# Altium schematic sheet Power.SchDoc: DC DC converter
size A4; Author: Sajitha Madugalle; Revision: 1; SheetNumber: 4; SheetTotal: 9
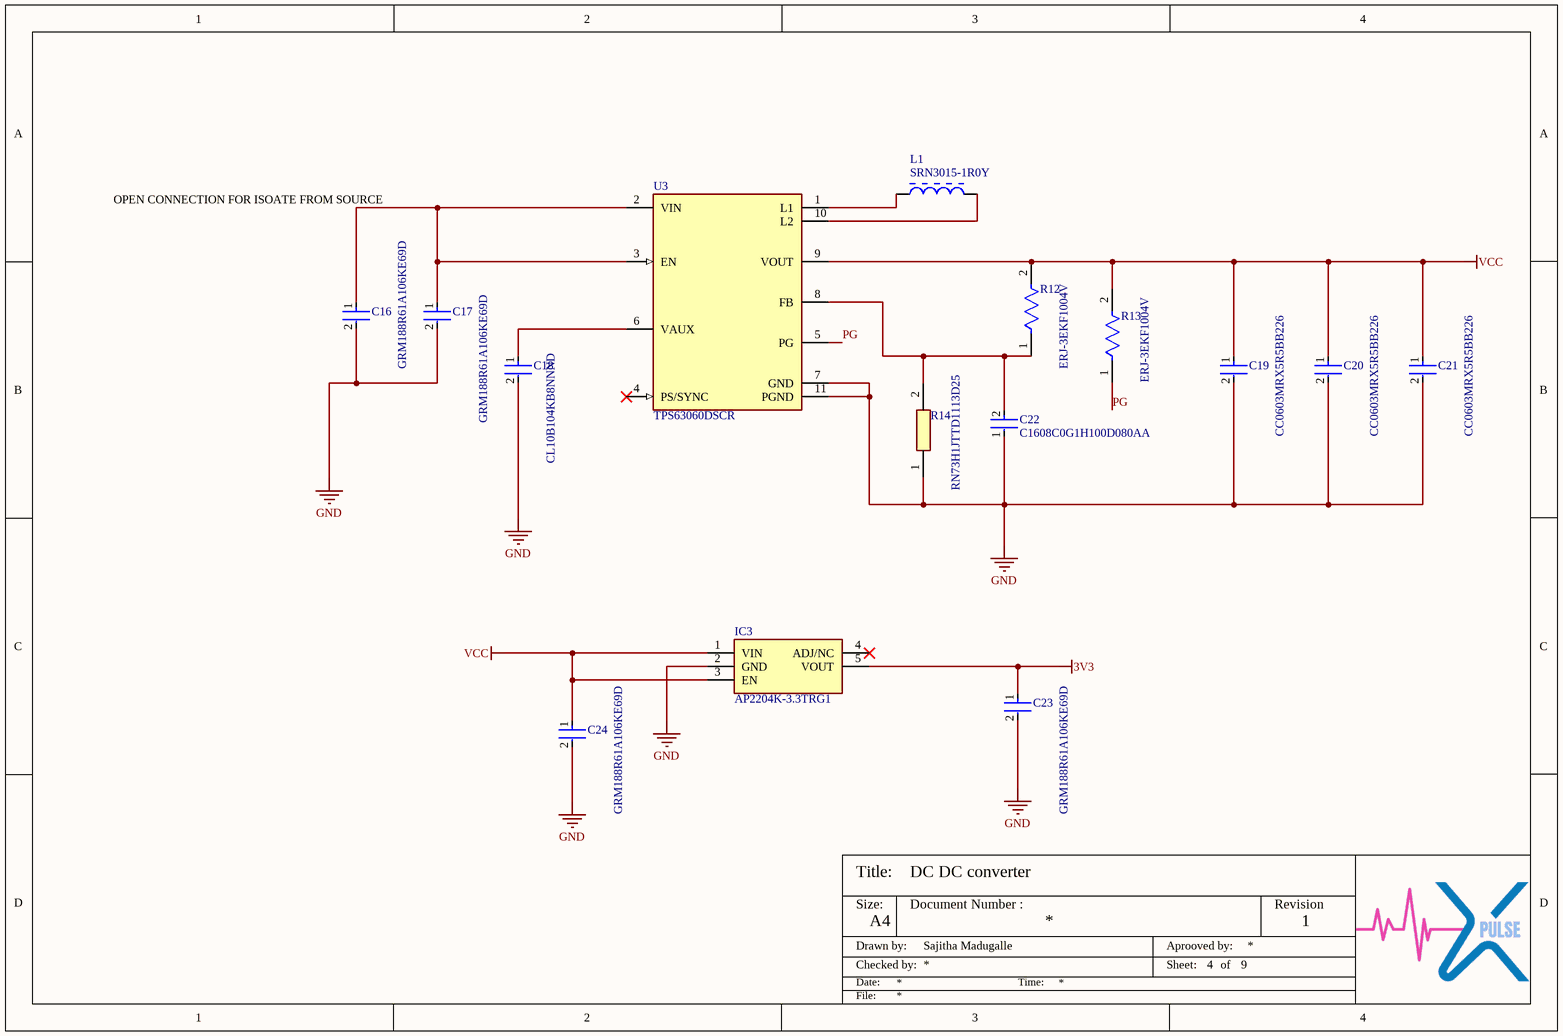
[diagram p0: Power.SchDoc]

## Parts
C16  GRM188R61A106KE69D  [FP-GRM18-0_15-MFG]
C17  GRM188R61A106KE69D  [FP-GRM18-0_15-MFG]
C18  CL10B104KB8NNND  [FP-CL10-IPC_A]
C19  CC0603MRX5R5BB226  [FP-CC0603-DC-MFG]
C20  CC0603MRX5R5BB226  [FP-CC0603-DC-MFG]
C21  CC0603MRX5R5BB226  [FP-CC0603-DC-MFG]
C22  C1608C0G1H100D080AA  [FP-C1608-080-0_1-IPC_C]
C23  GRM188R61A106KE69D  [FP-GRM18-0_15-MFG]
C24  GRM188R61A106KE69D  [FP-GRM18-0_15-MFG]
IC3  AP2204K-3.3TRG1  [SOT95P282X145-5N]
L1  SRN3015-1R0Y  [BOUR-SRN3015-2_V]
R12  ERJ-3EKF1004V  [FP-ERJ3EK-IPC_C]
R13  ERJ-3EKF1004V  [FP-ERJ3EK-IPC_C]
R14  RN73H1JTTD1113D25  [RESC1608X55N]
U3  TPS63060DSCR  [FP-DSC0010G-MFG]

## Nets
3V3: C23.1 IC3.5(VOUT)
GND: C16.2 C17.2 C18.2 C19.2 C20.2 C21.2 C22.1 C23.2 C24.2 IC3.2(GND) R14.1 U3.7(GND) U3.11(PGND)
VCC: C19.1 C20.1 C21.1 C24.1 IC3.1(VIN) IC3.3(EN) R12.2 R13.2 U3.9(VOUT)
PG: R13.1 U3.5(PG)
NetC16_1: C16.1 C17.1 U3.2(VIN) U3.3(EN)
NetC18_1: C18.1 U3.6(VAUX)
NetC22_2: C22.2 R12.1 R14.2 U3.8(FB)
NetL1_1: L1.1 U3.1(L1)
NetL1_2: L1.2 U3.10(L2)

Not connected (* = marked no-connect by the designer): IC3 4(ADJ/NC)*; U3 4(PS/SYNC)*

## Notes on the sheet
- OPEN CONNECTION FOR ISOATE FROM SOURCE
- Title:
- Size:
- Document Number :
- Revision
- Drawn by:
- Checked by:
- Date:
- A4
- Time:
- Aprooved by:
- Sheet:
- of
- File:

## Library data of the parts
C16 C17 C23 C24 = CMP-2000-05448-2: CAP CER 10UF 10V X5R 0603; Manufacturer: Murata; Temperature Coefficient: 15%; Material: Ceramic; Tolerance: 10%; Device Class L1: Passive Components; ComponentLink2Description: Datasheet; Height: 0.95mm; Package: GRM18-0.15; Octopart: https://octopart.com/grm188r61a106ke69d-murata-22851381; Manufacturer Part Number: GRM188R61A106KE69D; Value: 10uF; Digikey Description: CAP CER 10UF 10V X5R 0603; Temperature Range High: +85°C; Temperature Range Low: -55°C; Temperature Characteristic: X5R; Capacitance: 10uF; RoHS: TRUE; Device Class L2: Capacitors; ComponentLink2URL: https://search.murata.co.jp/Ceramy/image/img/A01X/G101/ENG/GRM188R61A106KE69-01A.pdf; Device Class L3: Ceramic Capacitors; Lead Free: Yes; Mouser Description: Multilayer Ceramic Capacitors MLCC - SMD/SMT 0603 10uF 10volts X5R + - 10%; Category: Cap; Voltage Rating: 10V; Temperature: -55°C to +85°C; Automotive: No
C18 = CMP-13271-000587-1: Cap Ceramic 100nF 50V X7R ±10% Pad SMD 0603 +125°C T/R; Case/Package: 0603; Depth: 0.8mm; Max Operating Temperature: 125°C; Lead Free: Lead Free; Material: Ceramic; Voltage Rating: 50V; Min Operating Temperature: -55°C; Voltage Rating (DC): 50V; Dielectric: X7R; Height: 0.8mm; Capacitance: 100nF; Thickness: 0.035inch; Radiation Hardening: No; Voltage: 50V; Packaging: Tape and Reel; Length: 1.6mm; Tolerance: 10%; Width: 0.031inch; Mount: Surface Mount; Package Quantity: 10000
C19-C21 = CMP-2000-06075-2: CAP CER 22UF 6.3V X5R 0603; Tolerance: 20%; Termination: SMD/SMT; Mount: Surface Mount; Depth: 0.8mm; Thickness: 0.035inch; Packaging: Tape and Reel; RoHS Compliant: Yes; Case/Package: 0603; Min Operating Temperature: -55°C; Package Quantity: 4000; Weight: 7.1E-05oz; Max Operating Temperature: 85°C; Voltage Rating (DC): 6.3V; Halogen Free: Halogen Free; Lead Free: Lead Free; Resistor Type: Ceramic; Case Code (Imperial): 0603; Width: 0.031inch; Case Code (Metric): 1608; Voltage Rating: 6.3V; Length: 0.063inch; Capacitance: 22uF; Dielectric: X5R
C22 = CMP-08246-005843-1: Multilayer Ceramic Capacitors 10pF ±0.5pF 50V C0G SMD 0603; Temperature Coefficient: 30ppm/°C; Tolerance: 5%; Termination: SMD/SMT; REACH SVHC: No SVHC; Package Quantity: 1; Case Code (Imperial): 0603; Number of Pins: 2; Capacitance: 10pF; Length: 1.6mm; Thickness: 0.037inch; Weight: 7.1E-05oz; Voltage Rating (DC): 50V; RoHS Compliant: Yes; Width: 0.031inch; Depth: 0.8mm; Case/Package: 0603; Dielectric Material: Ceramic; Voltage: 50V; Min Operating Temperature: -55°C; Case Code (Metric): 1608; Mount: Surface Mount; Height: 0.8mm; Construction: Flat; Series: C; Packaging: Tape and Reel; Radiation Hardening: No; Max Operating Temperature: 125°C; Lead Free: Lead Free; Voltage Rating: 50V; Dielectric: C0G
IC3 = AP2204K-3.3TRG1: Integrated Circuit; Manufacturer_Name: Diodes Incorporated; Datasheet Link: https://datasheet.datasheetarchive.com/originals/distributors/Datasheets_SAMA/5d52b656135dbfe7dbe35c76df69cd37.pdf; Height: 1.45mm; Manufacturer_Part_Number: AP2204K-3.3TRG1; Mouser Part Number: 621-AP2204K-3.3TRG1; Mouser Price/Stock: https://www.mouser.co.uk/ProductDetail/Diodes-Incorporated/AP2204K-3.3TRG1?qs=x6A8l6qLYDDMwVlYH0pN0g%3D%3D; Arrow Part Number: AP2204K-3.3TRG1; Arrow Price/Stock: https://www.arrow.com/en/products/ap2204k-3.3trg1/diodes-incorporated?region=nac
L1 = CMP-0007-00007-1: Semi-shielded Power Inductor, 1 uH, +/- 30%, 2.35 A, -40 to 125 degC, 3 x 3 x 1.5 mm SMD, RoHS and Halogen Free, Tape and Reel; Manufacturer: Bourns; Inductance tolerance: +/- 30%; DCR Max: 0.048 Ohm; Resistance to Solder Heat: +260 degC for 10 sec.; SRF Min: 145 MHz; Inductance: 1 uH; Isat: 2.35 A; ComponentLink3URL: http://www.bourns.com/data/global/pdfs/SRN3015.pdf; Packing: Tape and Reel; ComponentLink1Description: Manufacturer URL; DatasheetVersion: Aug-11; ComponentLink2URL: http://www.bourns.com/data/global/pdfs/SRN3015.pdf; PartNumber: SRN3015-1R0Y; ComponentLink3Description: Package Specification; RoHS: TRUE; Mounting Technology: Surface Mount; ComponentLink1URL: http://www.bourns.com/; Operating Temperature: -40 to 125 degC; Rated current: 2.35 A; PackageDescription: 2-Pin SMD, Body 3 x 3 mm, Height 1.5 mm; ComponentLink2Description: Datasheet; PackageReference: SRN3015
R12 R13 = CMP-1012-00849-3: RES SMD 1M OHM 1% 1/10W 0603; Resistance: 1MR; Voltage Rating: 75V; Temperature Coefficient: 100ppm/°C; Power Rating: 100mW; REACH SVHC: No SVHC; Radiation Hardening: No; Features: Automotive AEC-Q200; Case Code (Metric): 1608; Resistance Tolerance: 1%; Case/Package: 0603; Termination: SMD/SMT; Max Operating Temperature: 155°C; Tolerance: 1%; Size Code: 0603; Case Code (Imperial): 0603; Min Operating Temperature: -55°C; Number of Pins: 2; Mount: Surface Mount; Package Quantity: 1; Military Standard: Not; Voltage Rating (DC): 75V; Depth: 0.8mm; Packaging: Tape and Reel; Width: 0.8mm; Number of Terminations: 2; Length: 1.6mm; Height: 0.022inch; RoHS Compliant: Yes; Resistor Type: Thick Film; Contact Plating: Tin; Lead Free: Lead Free; Series: ERJ; Construction: Rectangular; Max Power Dissipation: 100mW
R14 = RN73H1JTTD1113D25: Resistor; Manufacturer_Name: KOA Speer; Datasheet Link: https://www.mouser.com/datasheet/2/219/RN73H-12200.pdf; Height: 0.55mm; Manufacturer_Part_Number: RN73H1JTTD1113D25; Mouser Part Number: 660-RN73H1JTD1113D25; Mouser Price/Stock: https://www.mouser.co.uk/ProductDetail/KOA-Speer/RN73H1JTTD1113D25?qs=0hon8nwgHrb8JI0BK8RpbQ%3D%3D
U3 = CMP-04918-000043-1: IC REG BCK BST ADJ 2A 10WSON; Manufacturer: Texas Instruments; Standoff Height: 0mm; Switching Frequency: 2400kHz; Min Supply Voltage: 2.5V; Number Of Outputs: 1; Output Voltage: 2.5-8V; Max Junction Temp: +125°C; Nominal Supply Current: 30uA; Output Type: AdjustableProgrammable; Output Current: 1A; Max Supply Voltage: 12V; Max Duty Cycle: 100%; Switching Topology: Buck-Boost; Octopart: https://octopart.com/tps63060dscr-texas+instruments-21396306; ComponentLink2Description: Datasheet; Category: IC; Ambient Temperature Range High: +85°C; Ipc Land Pattern Name: DFN300X300X70-10; Automotive: No; Manufacturer Part Number: TPS63060DSCR; Mouser Description: Voltage Regulators - Switching Regulators 2.5-12Vin,2.25A Sw Crnt Limit; Lead Free: Yes; Digikey Description: IC REG BCK BST ADJ 2A 10WSON; Device Class L3: Voltage Regulators - Switching; Ambient Temperature Range Low: -40°C; Temperature: -40°C to +85°C; Package: DSC0010G; Device Class L2: Power Management ICs; Device Class L1: Integrated Circuits (ICs); ComponentLink2URL: http://www.ti.com/lit/ds/symlink/tps63060.pdf; Temperature Range High: +85°C; Height: 0.8mm; RoHS: TRUE; Temperature Range Low: -40°C